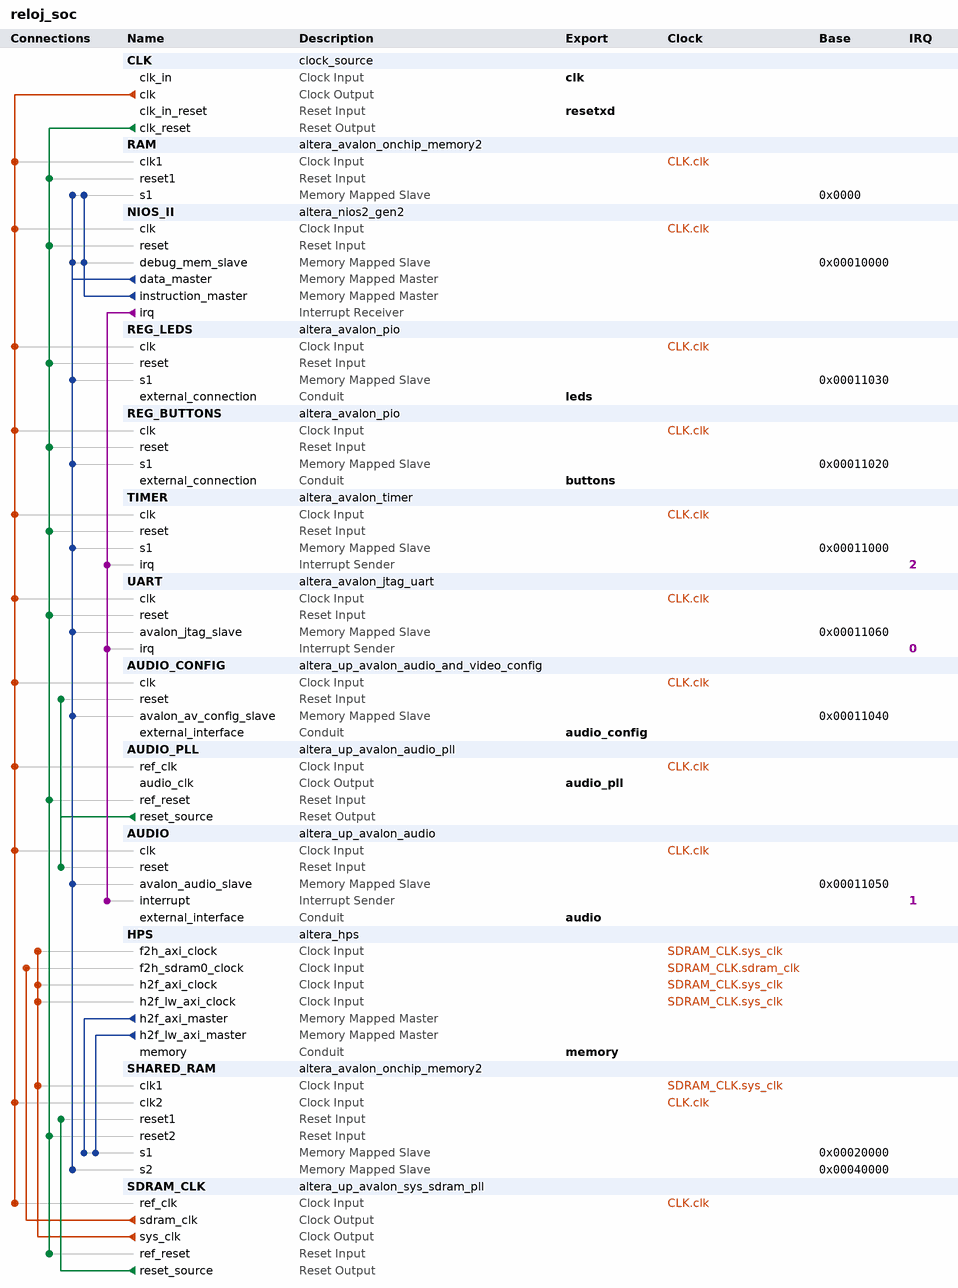
[diagram p0: system contents]
# Platform Designer (Qsys) system reloj_soc, Cyclone V 5CSEMA5F31C6
# Parameters at their usual value, and those the tool derives, are not listed.
package require -exact qsys 18.0
create_system reloj_soc
set_project_property DEVICE_FAMILY {Cyclone V}
set_project_property DEVICE 5CSEMA5F31C6

add_instance CLK clock_source 18.0
set_instance_parameter_value CLK clockFrequency 50000000

add_instance RAM altera_avalon_onchip_memory2 18.0
set_instance_parameter_value RAM dataWidth 32
set_instance_parameter_value RAM dualPort false
set_instance_parameter_value RAM initMemContent true
set_instance_parameter_value RAM initializationFileName onchip_mem.hex
set_instance_parameter_value RAM memorySize 65536

add_instance NIOS_II altera_nios2_gen2 18.0
set_instance_parameter_value NIOS_II dcache_size 2048
set_instance_parameter_value NIOS_II exceptionSlave RAM.s1
set_instance_parameter_value NIOS_II icache_size 4096
set_instance_parameter_value NIOS_II impl Tiny
set_instance_parameter_value NIOS_II resetSlave RAM.s1

add_instance REG_LEDS altera_avalon_pio 18.0
set_instance_parameter_value REG_LEDS direction Output
set_instance_parameter_value REG_LEDS width 32

add_instance REG_BUTTONS altera_avalon_pio 18.0
set_instance_parameter_value REG_BUTTONS direction Input
set_instance_parameter_value REG_BUTTONS simDoTestBenchWiring true
set_instance_parameter_value REG_BUTTONS simDrivenValue 170
set_instance_parameter_value REG_BUTTONS width 8

add_instance TIMER altera_avalon_timer 18.0
set_instance_parameter_value TIMER fixedPeriod true
set_instance_parameter_value TIMER period 1
set_instance_parameter_value TIMER periodUnits MSEC

add_instance UART altera_avalon_jtag_uart 18.0
set_instance_parameter_value UART simInteractiveOptions NO_INTERACTIVE_WINDOWS

add_instance AUDIO_CONFIG altera_up_avalon_audio_and_video_config 18.0
set_instance_parameter_value AUDIO_CONFIG audio_in {Microphone to ADC}
set_instance_parameter_value AUDIO_CONFIG bit_length 24
set_instance_parameter_value AUDIO_CONFIG board DE1-SoC
set_instance_parameter_value AUDIO_CONFIG line_in_bypass false
set_instance_parameter_value AUDIO_CONFIG sampling_rate {48 kHz}

add_instance AUDIO_PLL altera_up_avalon_audio_pll 18.0
set_instance_parameter_value AUDIO_PLL gui_refclk 50.0

add_instance AUDIO altera_up_avalon_audio 18.0
set_instance_parameter_value AUDIO audio_in false
set_instance_parameter_value AUDIO avalon_bus_type {Memory Mapped}
set_instance_parameter_value AUDIO dw 16

add_instance HPS altera_hps 18.0
set_instance_parameter_value HPS EMAC1_Mode N/A
set_instance_parameter_value HPS EMAC1_PinMuxing Unused
set_instance_parameter_value HPS F2SCLK_COLDRST_Enable false
set_instance_parameter_value HPS F2SCLK_DBGRST_Enable false
set_instance_parameter_value HPS F2SCLK_WARMRST_Enable false
set_instance_parameter_value HPS F2SDRAM_Type AXI-3
set_instance_parameter_value HPS F2SDRAM_Width 64
set_instance_parameter_value HPS F2SINTERRUPT_Enable false
set_instance_parameter_value HPS F2S_Width 2
set_instance_parameter_value HPS FPGA_PERIPHERAL_OUTPUT_CLOCK_FREQ_EMAC0_GTX_CLK 125
set_instance_parameter_value HPS FPGA_PERIPHERAL_OUTPUT_CLOCK_FREQ_EMAC0_MD_CLK 2.5
set_instance_parameter_value HPS FPGA_PERIPHERAL_OUTPUT_CLOCK_FREQ_EMAC1_GTX_CLK 125
set_instance_parameter_value HPS FPGA_PERIPHERAL_OUTPUT_CLOCK_FREQ_EMAC1_MD_CLK 2.5
set_instance_parameter_value HPS HPS_PROTOCOL DDR3
set_instance_parameter_value HPS I2C0_Mode N/A
set_instance_parameter_value HPS I2C0_PinMuxing Unused
set_instance_parameter_value HPS I2C1_Mode N/A
set_instance_parameter_value HPS I2C1_PinMuxing Unused
set_instance_parameter_value HPS LWH2F_Enable true
set_instance_parameter_value HPS MEM_BANKADDR_WIDTH 3
set_instance_parameter_value HPS MEM_CLK_FREQ 300.0
set_instance_parameter_value HPS MEM_CLK_FREQ_MAX 400.0
set_instance_parameter_value HPS MEM_COL_ADDR_WIDTH 8
set_instance_parameter_value HPS MEM_DQ_WIDTH 8
set_instance_parameter_value HPS MEM_DRV_STR RZQ/6
set_instance_parameter_value HPS MEM_ROW_ADDR_WIDTH 12
set_instance_parameter_value HPS MEM_RTT_NOM {ODT Disabled}
set_instance_parameter_value HPS MEM_RTT_WR {Dynamic ODT off}
set_instance_parameter_value HPS MEM_TCL 7
set_instance_parameter_value HPS MEM_TFAW_NS 37.5
set_instance_parameter_value HPS MEM_TINIT_US 499
set_instance_parameter_value HPS MEM_TMRD_CK 3
set_instance_parameter_value HPS MEM_TRAS_NS 40.0
set_instance_parameter_value HPS MEM_TRCD_NS 15.0
set_instance_parameter_value HPS MEM_TREFI_US 7.0
set_instance_parameter_value HPS MEM_TRFC_NS 75.0
set_instance_parameter_value HPS MEM_TRP_NS 15.0
set_instance_parameter_value HPS MEM_TWTR 2
set_instance_parameter_value HPS MEM_VENDOR JEDEC
set_instance_parameter_value HPS MEM_WTCL 6
set_instance_parameter_value HPS MPU_EVENTS_Enable true
set_instance_parameter_value HPS QSPI_Mode N/A
set_instance_parameter_value HPS QSPI_PinMuxing Unused
set_instance_parameter_value HPS REF_CLK_FREQ 125.0
set_instance_parameter_value HPS S2FCLK_USER2CLK 5
set_instance_parameter_value HPS S2F_Width 2
set_instance_parameter_value HPS SDIO_Mode N/A
set_instance_parameter_value HPS SDIO_PinMuxing Unused
set_instance_parameter_value HPS SPIM1_Mode N/A
set_instance_parameter_value HPS SPIM1_PinMuxing Unused
set_instance_parameter_value HPS STM_Enable false
set_instance_parameter_value HPS TIMING_BOARD_AC_SKEW 0.02
set_instance_parameter_value HPS TIMING_BOARD_AC_TO_CK_SKEW 0.0
set_instance_parameter_value HPS TIMING_BOARD_DQ_TO_DQS_SKEW 0.0
set_instance_parameter_value HPS TIMING_BOARD_MAX_CK_DELAY 0.6
set_instance_parameter_value HPS TIMING_BOARD_MAX_DQS_DELAY 0.6
set_instance_parameter_value HPS TIMING_BOARD_SKEW_BETWEEN_DQS 0.02
set_instance_parameter_value HPS TIMING_BOARD_SKEW_CKDQS_DIMM_MAX 0.01
set_instance_parameter_value HPS TIMING_BOARD_SKEW_CKDQS_DIMM_MIN -0.01
set_instance_parameter_value HPS TIMING_BOARD_SKEW_WITHIN_DQS 0.02
set_instance_parameter_value HPS TIMING_TDH 125
set_instance_parameter_value HPS TIMING_TDQSCK 400
set_instance_parameter_value HPS TIMING_TDQSQ 120
set_instance_parameter_value HPS TIMING_TDS 50
set_instance_parameter_value HPS TIMING_TIH 250
set_instance_parameter_value HPS TIMING_TIS 175
set_instance_parameter_value HPS TIMING_TQSH 0.38
set_instance_parameter_value HPS UART0_Mode N/A
set_instance_parameter_value HPS UART0_PinMuxing Unused
set_instance_parameter_value HPS USB1_Mode N/A
set_instance_parameter_value HPS USB1_PinMuxing Unused
set_instance_parameter_value HPS desired_cfg_clk_mhz 100.0
set_instance_parameter_value HPS desired_qspi_clk_mhz 400.0

add_instance SHARED_RAM altera_avalon_onchip_memory2 18.0
set_instance_parameter_value SHARED_RAM dataWidth 32
set_instance_parameter_value SHARED_RAM dualPort true
set_instance_parameter_value SHARED_RAM initMemContent true
set_instance_parameter_value SHARED_RAM initializationFileName onchip_mem.hex
set_instance_parameter_value SHARED_RAM memorySize 65536

add_instance SDRAM_CLK altera_up_avalon_sys_sdram_pll 18.0
set_instance_parameter_value SDRAM_CLK CV_boards DE1-SoC
set_instance_parameter_value SDRAM_CLK gui_outclk 50.0
set_instance_parameter_value SDRAM_CLK gui_refclk 50.0

# connections
add_connection CLK.clk AUDIO.clk clock
add_connection CLK.clk AUDIO_CONFIG.clk clock
add_connection CLK.clk AUDIO_PLL.ref_clk clock
add_connection CLK.clk NIOS_II.clk clock
add_connection CLK.clk RAM.clk1 clock
add_connection CLK.clk REG_BUTTONS.clk clock
add_connection CLK.clk REG_LEDS.clk clock
add_connection CLK.clk SDRAM_CLK.ref_clk clock
add_connection CLK.clk SHARED_RAM.clk2 clock
add_connection CLK.clk TIMER.clk clock
add_connection CLK.clk UART.clk clock
add_connection SDRAM_CLK.sdram_clk HPS.f2h_sdram0_clock clock
add_connection SDRAM_CLK.sys_clk HPS.f2h_axi_clock clock
add_connection SDRAM_CLK.sys_clk HPS.h2f_axi_clock clock
add_connection SDRAM_CLK.sys_clk HPS.h2f_lw_axi_clock clock
add_connection SDRAM_CLK.sys_clk SHARED_RAM.clk1 clock
add_connection AUDIO_PLL.reset_source AUDIO.reset reset
add_connection AUDIO_PLL.reset_source AUDIO_CONFIG.reset reset
add_connection CLK.clk_reset AUDIO_PLL.ref_reset reset
add_connection CLK.clk_reset NIOS_II.reset reset
add_connection CLK.clk_reset RAM.reset1 reset
add_connection CLK.clk_reset REG_BUTTONS.reset reset
add_connection CLK.clk_reset REG_LEDS.reset reset
add_connection CLK.clk_reset SDRAM_CLK.ref_reset reset
add_connection CLK.clk_reset SHARED_RAM.reset2 reset
add_connection CLK.clk_reset TIMER.reset reset
add_connection CLK.clk_reset UART.reset reset
add_connection SDRAM_CLK.reset_source SHARED_RAM.reset1 reset
add_connection HPS.h2f_axi_master SHARED_RAM.s1 avalon
set_connection_parameter_value HPS.h2f_axi_master/SHARED_RAM.s1 baseAddress 0x00020000
add_connection HPS.h2f_lw_axi_master SHARED_RAM.s1 avalon
set_connection_parameter_value HPS.h2f_lw_axi_master/SHARED_RAM.s1 baseAddress 0x00020000
add_connection NIOS_II.data_master AUDIO.avalon_audio_slave avalon
set_connection_parameter_value NIOS_II.data_master/AUDIO.avalon_audio_slave baseAddress 0x00011050
add_connection NIOS_II.data_master AUDIO_CONFIG.avalon_av_config_slave avalon
set_connection_parameter_value NIOS_II.data_master/AUDIO_CONFIG.avalon_av_config_slave baseAddress 0x00011040
add_connection NIOS_II.data_master NIOS_II.debug_mem_slave avalon
set_connection_parameter_value NIOS_II.data_master/NIOS_II.debug_mem_slave baseAddress 0x00010000
add_connection NIOS_II.data_master RAM.s1 avalon
set_connection_parameter_value NIOS_II.data_master/RAM.s1 baseAddress 0x0000
add_connection NIOS_II.data_master REG_BUTTONS.s1 avalon
set_connection_parameter_value NIOS_II.data_master/REG_BUTTONS.s1 baseAddress 0x00011020
add_connection NIOS_II.data_master REG_LEDS.s1 avalon
set_connection_parameter_value NIOS_II.data_master/REG_LEDS.s1 baseAddress 0x00011030
add_connection NIOS_II.data_master SHARED_RAM.s2 avalon
set_connection_parameter_value NIOS_II.data_master/SHARED_RAM.s2 baseAddress 0x00040000
add_connection NIOS_II.data_master TIMER.s1 avalon
set_connection_parameter_value NIOS_II.data_master/TIMER.s1 baseAddress 0x00011000
add_connection NIOS_II.data_master UART.avalon_jtag_slave avalon
set_connection_parameter_value NIOS_II.data_master/UART.avalon_jtag_slave baseAddress 0x00011060
add_connection NIOS_II.instruction_master NIOS_II.debug_mem_slave avalon
set_connection_parameter_value NIOS_II.instruction_master/NIOS_II.debug_mem_slave baseAddress 0x00010000
add_connection NIOS_II.instruction_master RAM.s1 avalon
set_connection_parameter_value NIOS_II.instruction_master/RAM.s1 baseAddress 0x0000
add_connection NIOS_II.irq AUDIO.interrupt interrupt
set_connection_parameter_value NIOS_II.irq/AUDIO.interrupt irqNumber 1
add_connection NIOS_II.irq TIMER.irq interrupt
set_connection_parameter_value NIOS_II.irq/TIMER.irq irqNumber 2
add_connection NIOS_II.irq UART.irq interrupt
set_connection_parameter_value NIOS_II.irq/UART.irq irqNumber 0

# exported interfaces
add_interface audio conduit end
set_interface_property audio EXPORT_OF AUDIO.external_interface
add_interface audio_config conduit end
set_interface_property audio_config EXPORT_OF AUDIO_CONFIG.external_interface
add_interface audio_pll clock source
set_interface_property audio_pll EXPORT_OF AUDIO_PLL.audio_clk
add_interface buttons conduit end
set_interface_property buttons EXPORT_OF REG_BUTTONS.external_connection
add_interface clk clock sink
set_interface_property clk EXPORT_OF CLK.clk_in
add_interface leds conduit end
set_interface_property leds EXPORT_OF REG_LEDS.external_connection
add_interface memory conduit end
set_interface_property memory EXPORT_OF HPS.memory
add_interface resetxd reset sink
set_interface_property resetxd EXPORT_OF CLK.clk_in_reset

set_interconnect_requirement {$system} qsys_mm.clockCrossingAdapter HANDSHAKE
set_interconnect_requirement {$system} qsys_mm.enableEccProtection FALSE
set_interconnect_requirement {$system} qsys_mm.insertDefaultSlave FALSE
set_interconnect_requirement {$system} qsys_mm.maxAdditionalLatency 1

save_system reloj_soc.qsys
